# Altium schematic sheet LogicCircuits.SchDoc: Logic circuits
size A4; CheckedBy: Joel Guerreiro; Author: Hildo Guillardi Júnior; Organization: UNICAMP / LCEE; Address1: University of Campinas - Brazil; Address2: Power Conditioning Laboratory; Address3: Licensed by GNU GPL 3.0; Revision: Joel Guerreiro; ProjectName: Easy Inverter
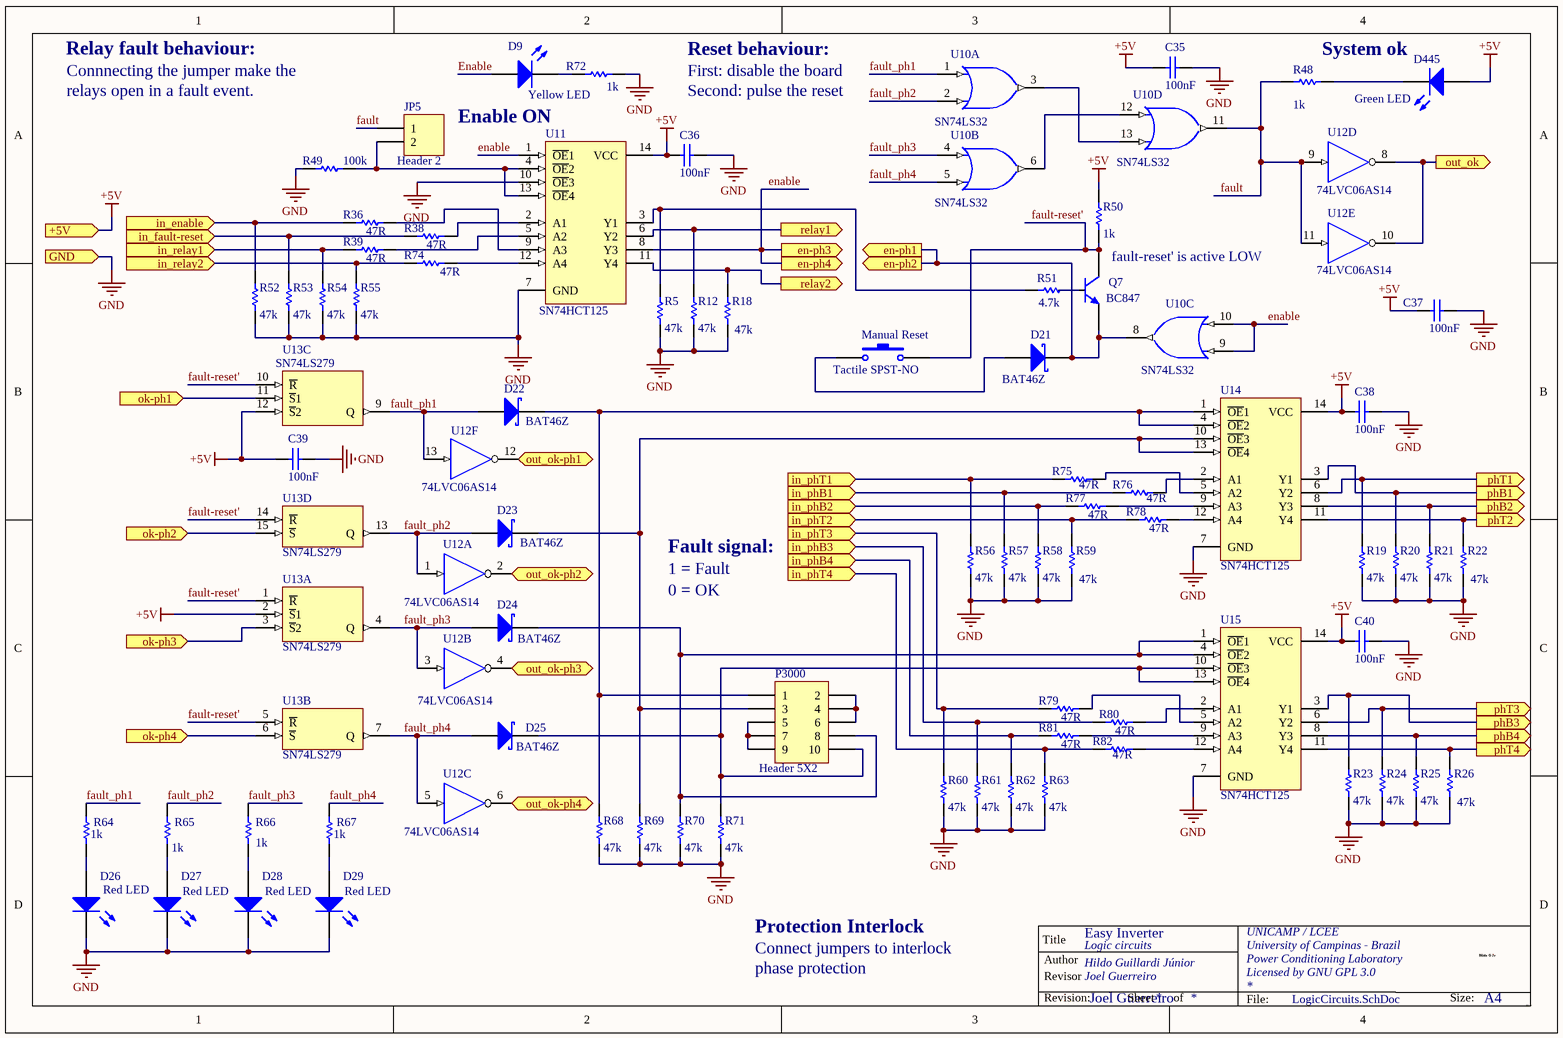
[diagram p0: LogicCircuits.SchDoc]

## Parts
C35  value 100nF  [0805_W]
C36  value 100nF  [0805_W]
C37  value 100nF  [0805_W]
C38  value 100nF  [0805_W]
C39  value 100nF  [0805_W]
C40  value 100nF  [0805_W]
D9  value Yellow LED  [LED_0805]
D21  value BAT46Z  [SOD-123]
D22  value BAT46Z  [SOD-123]
D23  value BAT46Z  [SOD-123]
D24  value BAT46Z  [SOD-123]
D25  value BAT46Z  [SOD-123]
D26  value Red LED  [LED_0805]
D27  value Red LED  [LED_0805]
D28  value Red LED  [LED_0805]
D29  value Red LED  [LED_0805]
D445  value Green LED  [LED_0805]
JP5  value Header 2  [HDR1X2]
Manual_Reset  value Tactile SPST-NO  [Tactile SPST-NO]
P3000  value Header 5X2  [HDR2X5]
Q7  value BC847  [SOT-23-TT3_N]
R5  value 47k  [0805_W]
R12  value 47k  [0805_W]
R18  value 47k  [0805_W]
R19  value 47k  [0805_W]
R20  value 47k  [0805_W]
R21  value 47k  [0805_W]
R22  value 47k  [0805_W]
R23  value 47k  [0805_W]
R24  value 47k  [0805_W]
R25  value 47k  [0805_W]
R26  value 47k  [0805_W]
R36  value 47R  [0805_W]
R38  value 47R  [0805_W]
R39  value 47R  [0805_W]
R48  value 1k  [0805_W]
R49  value 100k  [0805_W]
R50  value 1k  [0805_W]
R51  value 4.7k  [0805_W]
R52  value 47k  [0805_W]
R53  value 47k  [0805_W]
R54  value 47k  [0805_W]
R55  value 47k  [0805_W]
R56  value 47k  [0805_W]
R57  value 47k  [0805_W]
R58  value 47k  [0805_W]
R59  value 47k  [0805_W]
R60  value 47k  [0805_W]
R61  value 47k  [0805_W]
R62  value 47k  [0805_W]
R63  value 47k  [0805_W]
R64  value 1k  [0805_W]
R65  value 1k  [0805_W]
R66  value 1k  [0805_W]
R67  value 1k  [0805_W]
R68  value 47k  [0805_W]
R69  value 47k  [0805_W]
R70  value 47k  [0805_W]
R71  value 47k  [0805_W]
R72  value 1k  [0805_W]
R74  value 47R  [0805_W]
R75  value 47R  [0805_W]
R76  value 47R  [0805_W]
R77  value 47R  [0805_W]
R78  value 47R  [0805_W]
R79  pn: 47R  [0805_W]
R80  value 47R  [0805_W]
R81  value 47R  [0805_W]
R82  value 47R  [0805_W]
U10  value SN74LS32  [SO14-Wide]  (parts A,B,C,D of 4)
U11  value SN74HCT125  [SO14-Wide]
U12  value 74LVC06AS14  [SOIC-14N]  (parts A,B,C,D,E,F of 6)
U13  value SN74LS279  (parts A,B,C,D of 4)
U14  value SN74HCT125  [SO14-Wide]
U15  value SN74HCT125  [SO14-Wide]

## Ports
+5V (in), en-ph1 (out), en-ph2 (out), en-ph3 (out), en-ph4 (out), GND (in), in_enable (in), in_fault-reset (in), in_phB1 (in), in_phB2 (in), in_phB3 (in), in_phB4 (in), in_phT1 (in), in_phT2 (in), in_phT3 (in), in_phT4 (in), in_relay1 (in), in_relay2 (in), ok-ph1 (in), ok-ph2 (in), ok-ph3 (in), ok-ph4 (in), out_ok (out), out_ok-ph1 (out), out_ok-ph2 (out), out_ok-ph3 (out), out_ok-ph4 (out), phB1 (out), phB2 (out), phB3 (out), phB4 (out), phT1 (out), phT2 (out), phT3 (out), phT4 (out), relay1 (out), relay2 (out)

## Nets
+5V: C35.1 C36.1 C37.1 C38.1 C39.1 C40.1 D445.1(A) R50.2 U10.14(VCC) U11.14(VCC) U12.14(VCC) U13.2(~{S}1) U13.12(~{S}2) U13.16(VCC) U14.14(VCC) U15.14(VCC) ; port +5V
GND: C35.2 C36.2 C37.2 C38.2 C39.2 C40.2 D26.2(K) D27.2(K) D28.2(K) D29.2(K) R5.1 R12.1 R18.1 R19.1 R20.1 R21.1 R22.1 R23.1 R24.1 R25.1 R26.1 R49.2 R52.1 R53.1 R54.1 R55.1 R56.1 R57.1 R58.1 R59.1 R60.1 R61.1 R62.1 R63.1 R68.1 R69.1 R70.1 R71.1 R72.2 U10.7(GND) U11.7(GND) U11.10(~{OE}3) U12.7(GND) U13.8(GND) U14.7(GND) U15.7(GND) ; port GND
en-ph1: D21.2(K) Q7.2(E) U10.8(3Y) ; port en-ph1, port en-ph2
enable: D9.1(A) U10.9(3A) U10.10(3B) U11.1(~{OE}1) U11.8(Y3) ; port en-ph3, port en-ph4
fault: JP5.1 R48.1 U10.11(4Y) U12.9(4A) U12.11(5A)
fault-reset': Manual_Reset.1 Q7.3(C) R50.1 U13.1(~{R}) U13.5(~{R}) U13.10(~{R}) U13.14(~{R})
fault_ph1: D22.1(A) R64.2 U10.1(1A) U12.13(6A) U13.9(Q)
fault_ph2: D23.1(A) R65.2 U10.2(1B) U12.1(1A) U13.13(Q)
fault_ph3: D24.1(A) R66.2 U10.4(2A) U12.3(2A) U13.4(Q)
fault_ph4: D25.1(A) R67.2 U10.5(2B) U12.5(3A) U13.7(Q)
in_enable: R36.2 R52.2 ; port in_enable
in_fault-reset: R38.2 R53.2 ; port in_fault-reset
in_phB1: R57.2 R76.2 ; port in_phB1
in_phB2: R58.2 R77.2 ; port in_phB2
in_phB3: R61.2 R80.2 ; port in_phB3
in_phB4: R62.2 R81.2 ; port in_phB4
in_phT1: R56.2 R75.2 ; port in_phT1
in_phT2: R59.2 R78.2 ; port in_phT2
in_phT3: R60.2 R79.2 ; port in_phT3
in_phT4: R63.2 R82.2 ; port in_phT4
in_relay1: R39.2 R54.2 ; port in_relay1
in_relay2: R55.2 R74.2 ; port in_relay2
ok-ph1: U13.11(~{S}1) ; port ok-ph1
ok-ph2: U13.15(~{S}) ; port ok-ph2
ok-ph3: U13.3(~{S}2) ; port ok-ph3
ok-ph4: U13.6(~{S}) ; port ok-ph4
out_ok: U12.8(4~{Y}) U12.10(5~{Y}) ; port out_ok
out_ok-ph1: U12.12(6~{Y}) ; port out_ok-ph1
out_ok-ph2: U12.2(1~{Y}) ; port out_ok-ph2
out_ok-ph3: U12.4(2~{Y}) ; port out_ok-ph3
out_ok-ph4: U12.6(3~{Y}) ; port out_ok-ph4
phB1: R20.2 U14.3(Y1) ; port phB1
phB2: R21.2 U14.8(Y3) ; port phB2
phB3: R23.2 U15.3(Y1) ; port phB3
phB4: R25.2 U15.8(Y3) ; port phB4
phT1: R19.2 U14.6(Y2) ; port phT1
phT2: R22.2 U14.11(Y4) ; port phT2
phT3: R24.2 U15.6(Y2) ; port phT3
phT4: R26.2 U15.11(Y4) ; port phT4
relay1: R12.2 U11.6(Y2) ; port relay1
relay2: R18.2 U11.11(Y4) ; port relay2
NetD9_2: D9.2(K) R72.1
NetD21_1: D21.1(A) Manual_Reset.2
NetD22_2: D22.2(K) P3000.1 R68.2 U14.1(~{OE}1) U14.4(~{OE}2)
NetD23_2: D23.2(K) P3000.3 R69.2 U14.10(~{OE}3) U14.13(~{OE}4)
NetD24_2: D24.2(K) P3000.8 R70.2 U15.1(~{OE}1) U15.4(~{OE}2)
NetD25_2: D25.2(K) P3000.10 R71.2 U15.10(~{OE}3) U15.13(~{OE}4)
NetD26_1: D26.1(A) R64.1
NetD27_1: D27.1(A) R65.1
NetD28_1: D28.1(A) R66.1
NetD29_1: D29.1(A) R67.1
NetD445_2: D445.2(K) R48.2
NetJP5_2: JP5.2 R49.1 U11.4(~{OE}2) U11.13(~{OE}4)
NetP3000_2: P3000.2 P3000.4 P3000.6
NetP3000_5: P3000.5 P3000.7 P3000.9
NetQ7_1: Q7.1(B) R51.2
NetR5_2: R5.2 R51.1 U11.3(Y1)
NetR36_1: R36.1 U11.9(A3)
NetR38_1: R38.1 U11.2(A1)
NetR39_1: R39.1 U11.5(A2)
NetR74_1: R74.1 U11.12(A4)
NetR75_1: R75.1 U14.5(A2)
NetR76_1: R76.1 U14.2(A1)
NetR77_1: R77.1 U14.9(A3)
NetR78_1: R78.1 U14.12(A4)
NetR79_1: R79.1 U15.5(A2)
NetR80_1: R80.1 U15.2(A1)
NetR81_1: R81.1 U15.9(A3)
NetR82_1: R82.1 U15.12(A4)
NetU10_3: U10.3(1Y) U10.13(4B)
NetU10_6: U10.6(2Y) U10.12(4A)

## Notes on the sheet
- Relay fault behaviour:
- Connnecting the jumper make the
- relays open in a fault event.
- Reset behaviour:
- First: disable the board
- Second: pulse the reset
- System ok
- Enable ON
- fault-reset' is active LOW
- Fault signal:
- 1 = Fault
- 0 = OK
- Protection Interlock
- Connect jumpers to interlock
- phase protection
- Title
- Author
- Revisor
- Hildo G Jr
- Revision:
- Sheet
- of
- File:
- Size:
- A4
- HGJr

## Library data of the parts
C35 C36 = Capacitor_nao_polarizado: Capacitor nao polarizado; Value: Value
C37-C40 = Capacitor_nao_polarizado: Capacitor nao polarizado; pn: C0805C104K8RACTU
D9 = LED0: Typical INFRARED GaAs LED; pn: SML-LXR85YC-TR
D21 D23-D25 = D Schottky: Schottky Diode; np: BAT46ZFILM
D22 = D Schottky: Schottky Diode; pn: BAT46ZFILM
D26-D29 = LED0: Typical INFRARED GaAs LED; pn: SML-LXR85IC-TR
D445 = LED0: Typical INFRARED GaAs LED; pn: SML-LXR85GC-TR
JP5 = Header 2: Header, 2-Pin
Manual_Reset = SW-PB: Switch; pn: FSM4JH
P3000 = Header 5X2: Header, 5-Pin, Dual row
Q7 = BC847: NPN General-purpose Transistor; pn: BC847BLT1G
R5 R12 R18-R26 R52-R55 R68-R71 = Res_0805: Resistor; pn: RMCF0805JT47K0
R36 R38 R39 R74-R78 R80-R82 = Res_0805: Resistor; pn: RMCF0805JT47R0
R48 R50 R64-R67 R72 = Res_0805: Resistor; pn: RMCF0805JT1K00
R49 R56-R63 = Res_0805: Resistor; Manufacturer: Generic Components; Class: Passive; Published: 08/06/2000; Publisher: Altium Hobart Technology Centre; SubClass: Resistor; Value: Value
R51 = Res_0805: Resistor; pn: RMCF0805JT4K70
R79 = Res_0805: Resistor; Published: RMCF0805JT47R0
U10 = HD74HC32FP: Quad 2-Input OR Gates; pn: SN74LS32NSR
U11 = M74HC125M1R: Quad Bus Buffer (3-State); pn: SN74HCT125DR
U12 = HD74LV06AFP: Hex Inverter Buffers / Drivers with Open Drain Outputs; Publisher: 74LVC06AS14-13
U13 = SN74LS279AD: Quadruple S-R Latches; pn: SN74LS279ANSR
U14 U15 = M74HC125M1R: Quad Bus Buffer (3-State); Publisher: SN74HCT125DR